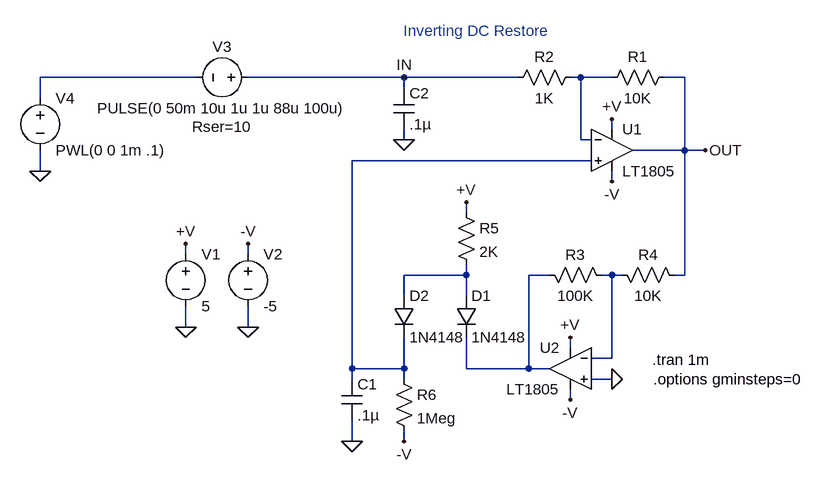
[diagram p0: schematic 1805.asc]
1805.asc, the LTspice schematic file:
Version 4
SHEET 1 896 740
WIRE -464 80 -704 80
WIRE -144 80 -384 80
WIRE 32 80 -144 80
WIRE 128 80 112 80
WIRE 176 80 128 80
WIRE 288 80 256 80
WIRE -144 96 -144 80
WIRE -704 112 -704 80
WIRE 176 160 176 144
WIRE -144 176 -144 160
WIRE 128 176 128 80
WIRE 144 176 128 176
WIRE 288 192 288 80
WIRE 288 192 208 192
WIRE 320 192 288 192
WIRE 144 208 -224 208
WIRE -704 224 -704 192
WIRE 176 240 176 224
WIRE -48 288 -48 272
WIRE -480 352 -480 336
WIRE -384 352 -384 336
WIRE -48 384 -48 368
WIRE -48 384 -144 384
WIRE 80 384 48 384
WIRE 176 384 160 384
WIRE 192 384 176 384
WIRE 288 384 288 192
WIRE 288 384 272 384
WIRE -144 416 -144 384
WIRE -48 416 -48 384
WIRE -480 464 -480 432
WIRE -384 464 -384 432
WIRE 112 496 112 480
WIRE 176 512 176 384
WIRE 176 512 144 512
WIRE -224 528 -224 208
WIRE -144 528 -144 480
WIRE -144 528 -224 528
WIRE -48 528 -48 480
WIRE 48 528 48 384
WIRE 48 528 -48 528
WIRE 80 528 48 528
WIRE -224 544 -224 528
WIRE -144 544 -144 528
WIRE 176 544 144 544
WIRE 112 576 112 560
WIRE -224 640 -224 608
WIRE -144 640 -144 624
FLAG -480 464 0
FLAG 176 144 +V
FLAG -480 336 +V
FLAG 176 240 -V
FLAG -384 464 0
FLAG -384 336 -V
FLAG 112 480 +V
FLAG 112 576 -V
FLAG 176 544 0
FLAG -48 272 +V
FLAG -224 640 0
FLAG -704 224 0
FLAG 320 192 OUT
FLAG -144 640 -V
FLAG -144 176 0
FLAG -144 80 IN
SYMBOL voltage -480 336 R0
SYMATTR InstName V1
SYMATTR Value 5
SYMBOL voltage -384 336 R0
SYMATTR InstName V2
SYMATTR Value -5
SYMBOL res 272 64 R90
WINDOW 0 0 56 VBottom 0
WINDOW 3 32 56 VTop 0
SYMATTR InstName R1
SYMATTR Value 10K
SYMBOL res 128 64 R90
WINDOW 0 0 56 VBottom 0
WINDOW 3 32 56 VTop 0
SYMATTR InstName R2
SYMATTR Value 1K
SYMBOL res 64 368 M90
WINDOW 0 0 56 VBottom 0
WINDOW 3 32 56 VTop 0
SYMATTR InstName R3
SYMATTR Value 100K
SYMBOL res 176 368 M90
WINDOW 0 0 56 VBottom 0
WINDOW 3 32 56 VTop 0
SYMATTR InstName R4
SYMATTR Value 10K
SYMBOL diode -64 416 R0
SYMATTR InstName D1
SYMATTR Value 1N4148
SYMBOL diode -160 416 R0
SYMATTR InstName D2
SYMATTR Value 1N4148
SYMBOL res -64 272 R0
SYMATTR InstName R5
SYMATTR Value 2K
SYMBOL res -160 528 R0
SYMATTR InstName R6
SYMATTR Value 1Meg
SYMBOL cap -240 544 R0
SYMATTR InstName C1
SYMATTR Value .1µ
SYMBOL voltage -368 80 R90
WINDOW 39 60 56 VTop 0
WINDOW 0 -32 56 VBottom 0
WINDOW 3 32 56 VTop 0
SYMATTR SpiceLine Rser=10
SYMATTR InstName V3
SYMATTR Value PULSE(0 50m 10u 1u 1u 88u 100u)
SYMBOL voltage -704 96 R0
WINDOW 123 0 0 Left 0
WINDOW 39 0 0 Left 0
SYMATTR InstName V4
SYMATTR Value PWL(0 0 1m .1)
SYMBOL cap -160 96 R0
SYMATTR InstName C2
SYMATTR Value .1µ
SYMBOL opamps\\LT1805 176 192 R0
SYMATTR InstName U1
SYMBOL opamps\\LT1805 112 528 M0
SYMATTR InstName U2
TEXT 238 514 Left 0 !.tran 1m
TEXT 240 544 Left 0 !.options gminsteps=0
TEXT -32 24 Bottom 0 ;Inverting DC Restore

The netlist it stands for:
* 1805.asc
V1 +V 0 5
V2 -V 0 -5
R1 OUT N002 10K
R2 N002 IN 1K
R3 N005 N006 100K
R4 N006 OUT 10K
D1 N004 N005 1N4148
D2 N004 N003 1N4148
R5 +V N004 2K
R6 N003 -V 1Meg
C1 N003 0 .1µ
V3 IN N001 PULSE(0 50m 10u 1u 1u 88u 100u) Rser=10
V4 N001 0 PWL(0 0 1m .1)
C2 IN 0 .1µ
* U1: LT1805 (symbol opamps\LT1805 not available, pins judged from their places): In+=N003 In-=N002 V+=+V V-=-V OUT=OUT
* U2: LT1805 (symbol opamps\LT1805 not available, pins judged from their places): In+=0 In-=N006 V+=+V V-=-V OUT=N005
.model D D
.lib standard.dio
.tran 1m
.options gminsteps=0
* Inverting DC Restore
.backanno
.end